# EAGLE design PoE (EAGLE 9.5.2)
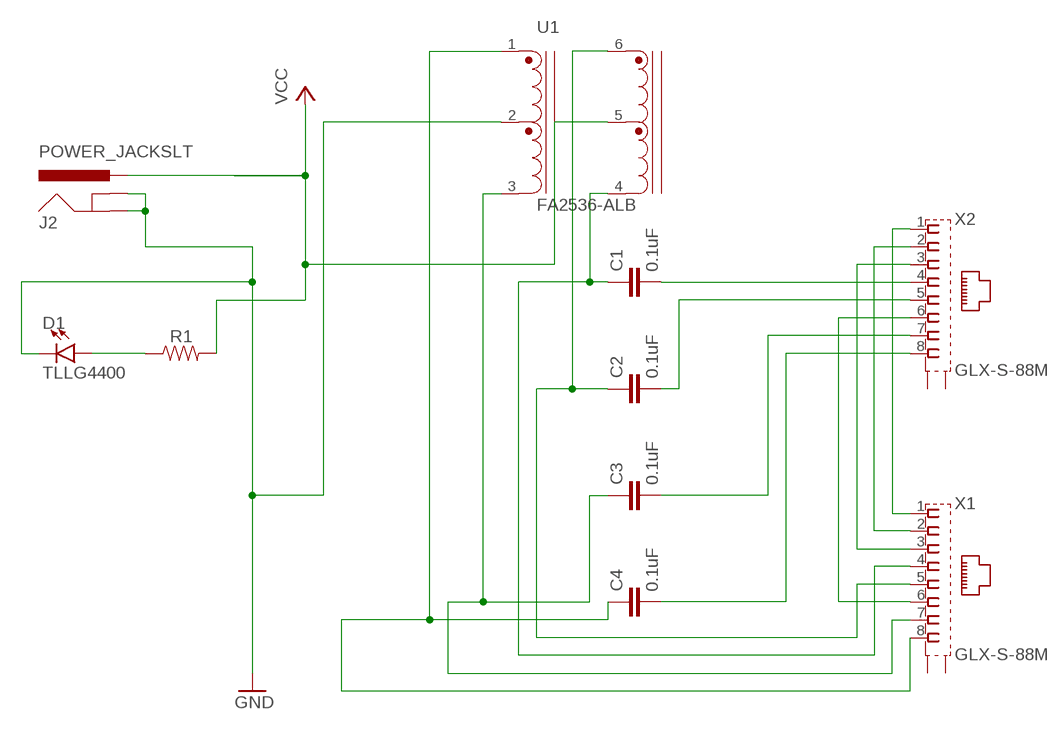
[diagram p0: schematic, sheet 1]

## Parts
C1  0.1uF  0.1UF-KIT-EZ-50V-20%  [CAP-PTH-SMALL-KIT]
C2  0.1uF  0.1UF-KIT-EZ-50V-20%  [CAP-PTH-SMALL-KIT]
C3  0.1uF  0.1UF-KIT-EZ-50V-20%  [CAP-PTH-SMALL-KIT]
C4  0.1uF  0.1UF-KIT-EZ-50V-20%  [CAP-PTH-SMALL-KIT]
D1  TLLG4400  LED3MM  [LED_3MM]
J2  POWER_JACKSLT  [POWER_JACK_SLOT]
R1  RESISTORAXIAL-0.3  [AXIAL-0.3]
U1  FA2536-ALB  [POE_FA2536-ALB]
X1  GLX-S-88M  [GLX-S-88M]
X2  GLX-S-88M  [GLX-S-88M]

## Nets
GND: D1.K(C) J2.GND@1(GNDBREAK) J2.GND@2(GND) U1.2
N$1: D1.A R1.P$1
N$2: X1.1 X2.1
N$3: X1.2 X2.2
N$4: X1.3 X2.3
N$5: X1.6 X2.6
N$6: C1.2 X2.4
N$7: C2.2 X2.5
N$8: C3.2 X2.7
N$9: C4.2 X2.8
N$10: C1.1 U1.4 X1.4
N$11: C2.1 U1.6 X1.5
N$14: C4.1 U1.1 X1.8
N$15: C3.1 U1.3 X1.7
VCC: J2.PWR R1.P$2 U1.5
Unconnected: X1.S1 X1.S2 X2.S1 X2.S2

## Library data of the parts
C1-C4 = SparkFun-Capacitors:0.1UF: 0.1µF ceramic capacitors A capacitor is a passive two-terminal electrical component used to store electrical energy temporarily in an electric field.; PROD_ID: CAP-08370
D1 = SparkFun-LED:LED: LED (Generic) Standard schematic elements and footprints for 5mm, 3mm, 1206, and 0603 sized LEDs. Generic LEDs with no color specified.; PROD_ID: DIO-08794
J2 = SparkFun-Connectors:POWER_JACK: Power Jack Connector This is the standard 5.5mm barrel jack for power. The PTH is the most common, proven, reliable, footprint. The Slot footprint only works if the mill layer is transmitted to the PCB fab house so be warned. Here are the connectors we sell at SparkFun: DC Barrel Power Jack/Connector <https://www.sparkfun.com/products/119> (PRT-00119) DC Barrel Power Jack/Connector (SMD) <https://www.sparkfun.com/products/12748> (PRT-12748) DC Barrel Jack Adapter - Breadboard Compatible <https://www.sparkfun.com/products/10811> (PRT-10811) It is used on this SparkFun product (and many, many others): SparkFun RedBoard - Programmed with Arduino <https://www.sparkfun.com/products/12757> (DEV-12757) Also, if you need a mating power supply or connector, please check these out: Wall Adapter Power Supply - 9VDC 650mA <https://www.sparkfun.com/products/298> (TOL-00298) DC Barrel Jack Adapter - Male <https://www.sparkfun.com/products/10287> (PRT-10287); PROD_ID: PRT-00119
R1 = SparkFun-Resistors:RESISTOR: Generic Resistor Package
U1 = FA2536-ALB:FA2536-ALB: Mid-Span PoE Plus Magnetics For 2-Line Systems; AVAILABILITY: Unavailable; MF: Coilcraft; MP: FA2536-ALB; PACKAGE: Package Analog Devices; PRICE: None
X1 X2 = con-kycon:GLX-S-88M: Mod. Jack, Right Angle, 8 posiotion, 8 contatcs RJ45 Source: GLX-S-88M.pdf; OC_FARNELL: unknown; OC_NEWARK: unknown

## Board
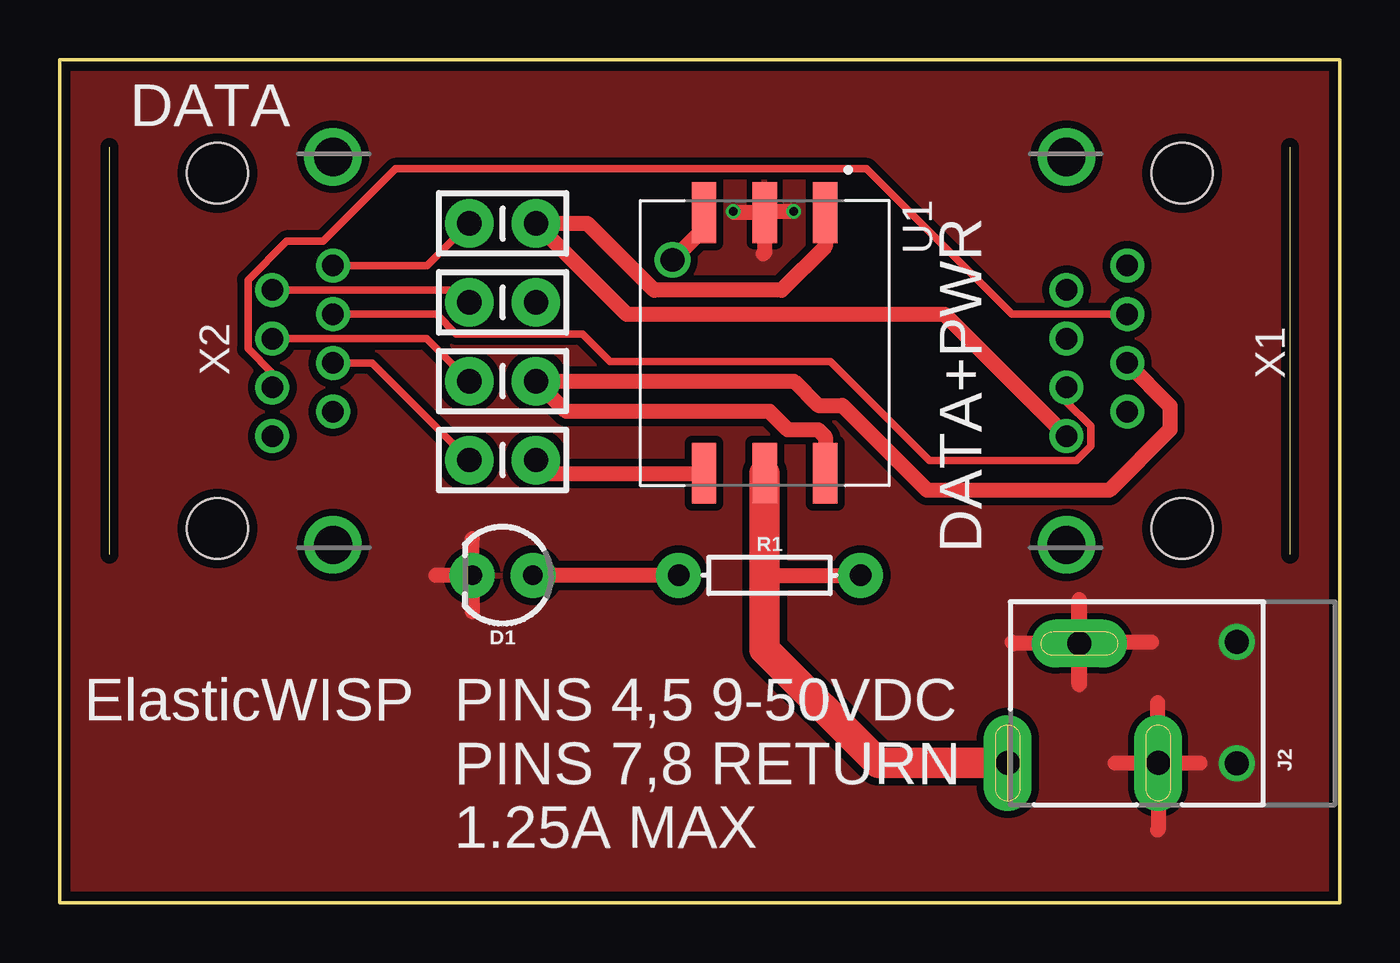
[diagram p1: board, top side]
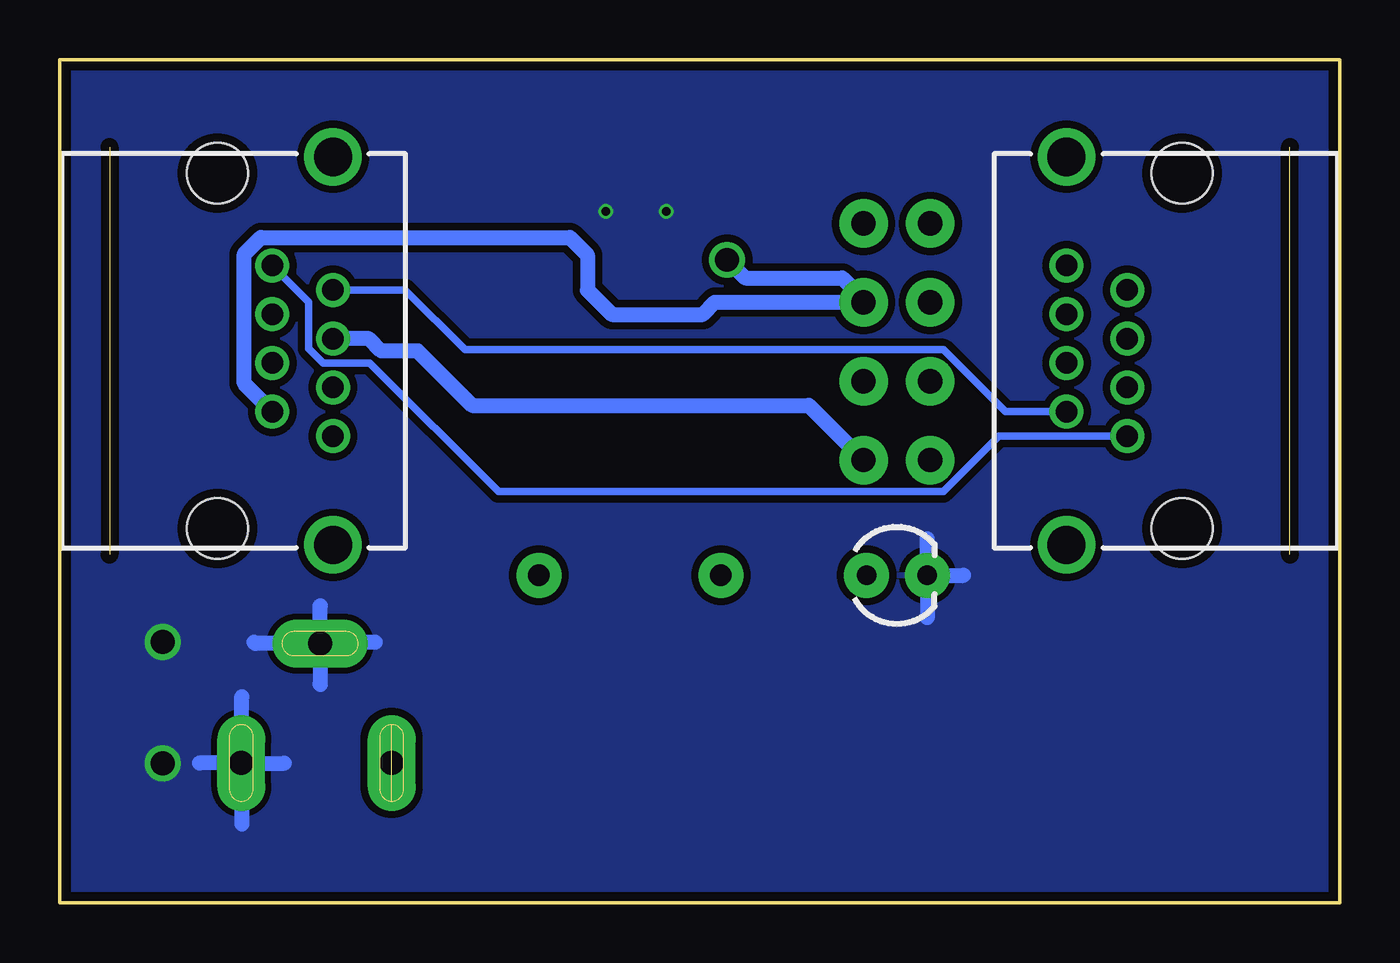
[diagram p2: board, bottom side, seen from below]

Size 53.59 x 35.31 mm. Coordinates in mm from the lower left corner, seen from the top.
Outline: 0,35.31 53.59,35.31 53.59,0 0,0 0,35.31
Copper layers (1*16): Top 0.035559375mm / dielectric 1.6mm / Bottom 0.035559375mm
Design rules "oshpark-2layer *": minimum track width 6mil, minimum drill 10mil, track to track 6mil, track to pad 6mil, pad to pad 6mil, via to via 6mil, smd to smd 6mil, copper to edge 15mil, drill to drill 6mil, minimum pad ring 5mil, minimum via ring 5mil, stop-mask expansion 2.5mil, vias tented up to drill 0mil, thermal gap 10mil

### Footprints (pad centres in the part's own frame; a part is rotated, then mirrored left to right if it is on the bottom)
CAP-PTH-SMALL-KIT = drill 1.016 pad 2.032: 1 -1.397,0; 2 1.397,0
LED_3MM = drill 0.813 pad 1.88: A -1.27,0; K 1.27,0
POWER_JACK_SLOT = drill 1 pad 2 long: GND@1 2.58,7.5; GND@2 7.58,10.8; PWR 2.58,13.8
AXIAL-0.3 = drill 0.9 pad 1.88: P$1 -3.81,0; P$2 3.81,0
POE_FA2536-ALB = smd 2.54 x 1.02: 1 -5.46,2.54; 2 -5.46,0; 3 -5.46,-2.54; 4 5.46,-2.54; 5 5.46,0; 6 5.46,2.54
GLX-S-88M = drill 0.9 pad 1.422: 1 -3.57,-2.3; 2 -2.55,-4.84; 3 -1.53,-2.3; 4 -0.51,-4.84; 5 0.51,-2.3; 6 1.53,-4.84; 7 2.55,-2.3; 8 3.57,-4.84 | drill 1.6 pad 2.184: S1 -8.125,-4.84; S2 8.125,-4.84 | hole 2.55: -7.44,0; 7.44,0

### Placement (x,y rotation side)
C1  18.54,18.54 180 top
C2  18.54,21.84 180 top
C3  18.54,25.15 180 top
C4  18.54,28.45 180 top
D1  18.54,13.72 180 top
J2  53.49,3.28 90 top
R1  29.72,13.72 0 top
U1  29.51,23.44 270 top
X1  46.99,23.11 270 top
X2  6.6,23.11 90 top

### Tracks (layer width: path | path; a pad name or v marks a point on that pad's centre or on a via)
GND  (via drill 0.35, 1)
  Top 0.635: J2.GND@2 42.67,10.88 42.67,12.7 42.69,12.68 J2.GND@2 | J2.GND@2 42.69,9.16 42.67,9.14 42.67,10.84 J2.GND@2 | J2.GND@2 42.76,10.92 45.72,10.92 | J2.GND@2 39.94,10.86 39.88,10.92 | J2.GND@1 45.97,5.88 45.97,8.38 | J2.GND@1 47.74,5.86 47.75,5.84 | J2.GND@1 45.99,3.07 45.97,3.05 | J2.GND@1 45.98,5.84 44.2,5.84 | D1.K 17.27,12.19 | D1.K 17.27,15.24 | D1.K 15.75,13.72 | U1.2 29.57,28.96 v30.73,28.96 | U1.2 28.25,28.9 v28.19,28.96 | U1.2 29.52,27.23 29.46,27.18
  Bottom 0.635: J2.GND@1 45.97,5.88 45.97,8.64 | J2.GND@1 47.74,5.86 47.75,5.84 | J2.GND@1 45.98,5.84 44.2,5.84 | J2.GND@1 45.97,5.84 45.97,3.3 | J2.GND@2 45.4,10.86 45.47,10.92 | J2.GND@2 42.69,12.43 42.67,12.45 | J2.GND@2 42.63,10.92 40.39,10.92 | J2.GND@2 42.69,9.16 42.67,9.14 | D1.K 17.27,15.24 | D1.K 17.27,11.94 | D1.K 15.75,13.72
  other vias: 49.28,10.92 49.28,5.84
  pour Top (isolate 0.305): 0,35.31 53.59,35.31 53.59,0 0,0
  pour Bottom (isolate 0.305): 0,35.31 53.59,35.31 53.59,0 0,0
N$1
  Top 0.635: R1.P$1 D1.A
N$2
  Bottom 0.305: X1.1 43.17,25.16 43.17,23.2 42.57,22.61 40.61,22.61 35.23,17.22 16.6,17.22 14.28,19.54 X2.1
N$3
  Bottom 0.305: X2.2 14,20.56 16.6,23.16 36.63,23.16 39.13,25.66 X1.2
N$4
  Top 0.305: X1.3 39.87,24.64 33.78,30.73 14.06,30.73 11.02,27.7 9.5,27.7 7.89,26.09 7.89,23.2 8.9,22.19 X2.3
N$5
  Top 0.305: X1.6 42.15,20.98 43.17,19.97 43.17,19.12 42.57,18.53 36.4,18.53 32.26,22.67 23.05,22.67 21.89,23.83 16.6,23.83 15.78,24.64 X2.6
N$6
  Top 0.305: C1.2 13.08,22.6 X2.4
N$7
  Top 0.305: X2.5 15.37,23.62 C2.2
N$8
  Top 0.305: X2.7 16.63,25.66 C3.2
N$9
  Top 0.305: X2.8 15.38,26.68 C4.2
N$10
  Top 0.635: C1.1 20.5,17.98 U1.4
  Bottom 0.635: X1.4 40.64,23.62 40.13,23.11 38.61,23.11 36.32,20.83 22.23,20.83 C1.1
N$11
  Top 0.635: X1.5 46.48,20.81 46.48,19.81 43.94,17.27 36.32,17.27 32.77,20.83 31.75,20.83 30.73,21.84 C2.1 21.21,20.57 29.72,20.57 30.48,19.81 31.75,19.81 32.05,19.51 U1.6
N$14
  Top 0.635: X1.8 37.06,24.64 23.75,24.64 C4.1 22.1,28.45 24.89,25.65 30.23,25.65 32.05,27.48 U1.1
N$15  (via drill 1)
  Top 0.635: U1.3 26.92,28.85 26.92,28.19 v25.65,26.92
  Bottom 0.635: X1.7 45.87,21.75 45.87,27.17 45.18,27.87 32.24,27.87 31.5,27.12 31.5,25.65 30.48,24.64 26.67,24.64 26.16,25.15 C3.1 19.94,25.27 20.83,26.16 24.89,26.16 v25.65,26.92
VCC
  Top 0.635: 29.52,13.97 29.77,13.72 R1.P$2
  Top 1.27: U1.5 29.52,13.97 29.52,10.62 34.27,5.86 J2.PWR

### Text on the board
tPlace: DATA | DATA+PWR | ElasticWISP | PINS 4,5 9-50VDC / PINS 7,8 RETURN / 1.25A MAX